# Altium schematic sheet Sheet2.SchDoc
size A3 portrait; SheetNumber: 1; SheetTotal: 1
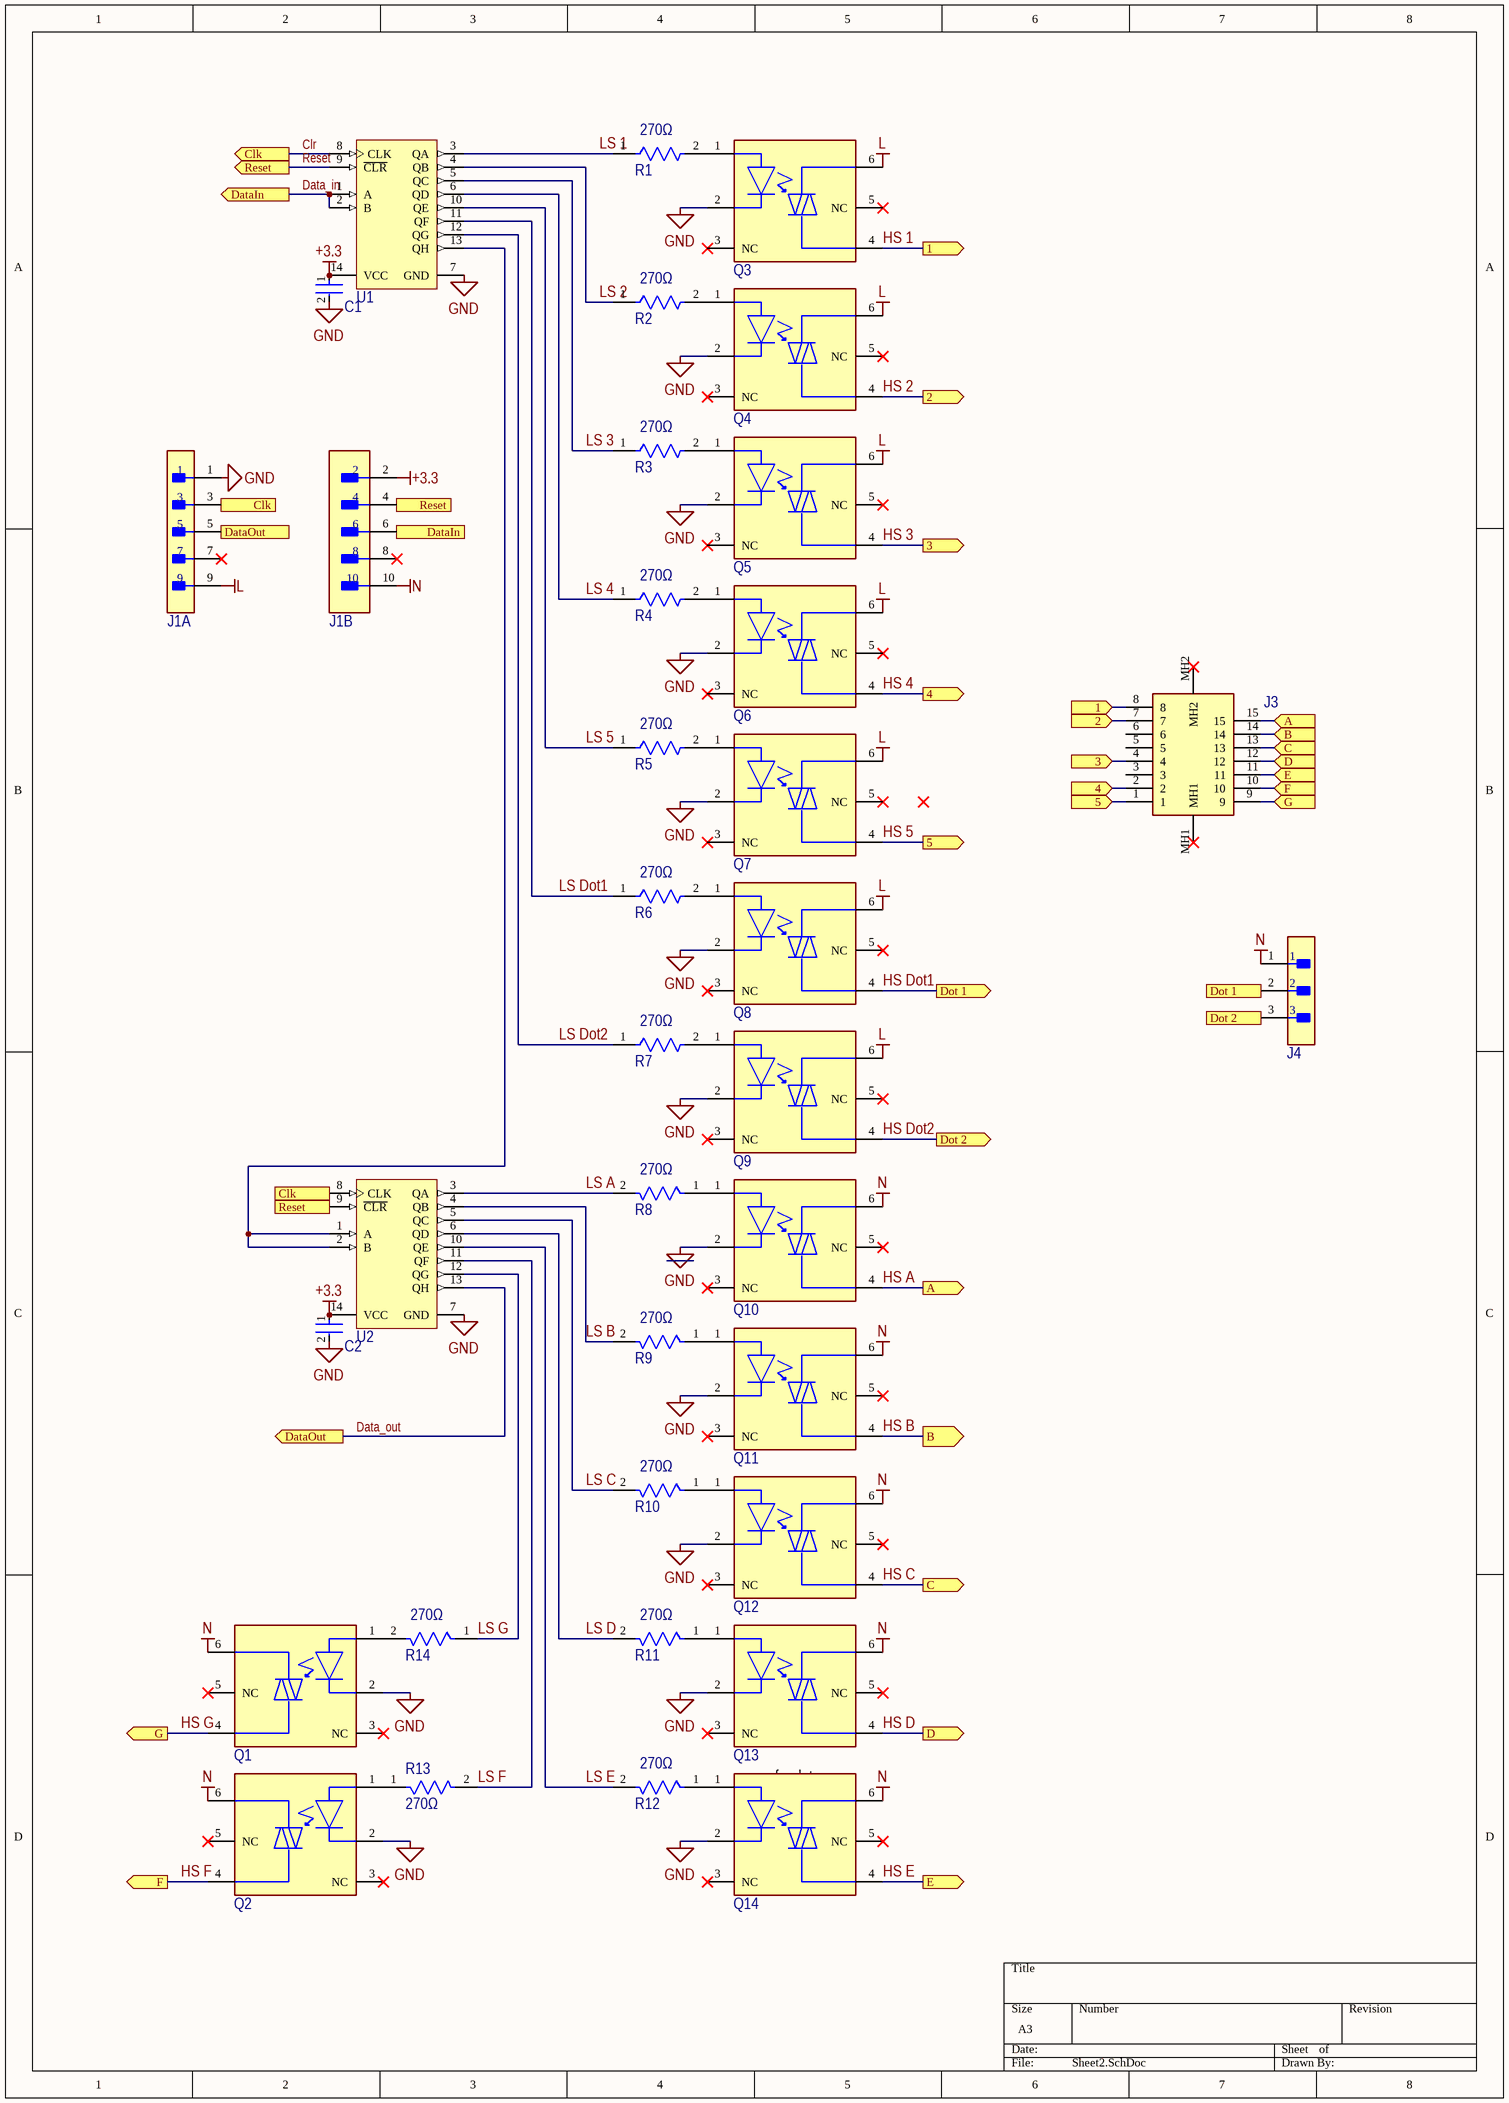
[diagram p0: Sheet2.SchDoc]

## Parts
C1  C0805C104M5RACTU  [FP-C0805C-DN-IPC_B]  (value not drawn)
C2  C0805C104M5RACTU  [FP-C0805C-DN-IPC_B]  (value not drawn)
J1  3220-10-0100-00  [FP-3220-10-0100-00-MFG]  (value not drawn)  (parts A,B of 2)
J3  2301828-1  [23018281]  (value not drawn)
J4  B3B-XH-A(LF)(SN)  [FP-B3B-XH-A_LF_SN-MFG]  (value not drawn)  (no BOM)
Q1  MOC3063SR2VM  [FP-646BY-MFG]  (value not drawn)
Q2  MOC3063SR2VM  [FP-646BY-MFG]  (value not drawn)
Q3  MOC3063SR2VM  [FP-646BY-MFG]  (value not drawn)
Q4  MOC3063SR2VM  [FP-646BY-MFG]  (value not drawn)
Q5  MOC3063SR2VM  [FP-646BY-MFG]  (value not drawn)
Q6  MOC3063SR2VM  [FP-646BY-MFG]  (value not drawn)
Q7  MOC3063SR2VM  [FP-646BY-MFG]  (value not drawn)
Q8  MOC3063SR2VM  [FP-646BY-MFG]  (value not drawn)
Q9  MOC3063SR2VM  [FP-646BY-MFG]  (value not drawn)
Q10  MOC3063SR2VM  [FP-646BY-MFG]  (value not drawn)
Q11  MOC3063SR2VM  [FP-646BY-MFG]  (value not drawn)
Q12  MOC3063SR2VM  [FP-646BY-MFG]  (value not drawn)
Q13  MOC3063SR2VM  [FP-646BY-MFG]  (value not drawn)
Q14  MOC3063SR2VM  [FP-646BY-MFG]  (value not drawn)
R1  value 270Ω  [FP-CRGCQ0603-IPC_C]  (hidden comment: CRGCQ0603F270R)
R2  value 270Ω  [FP-CRGCQ0603-IPC_C]  (hidden comment: CRGCQ0603F270R)
R3  value 270Ω  [FP-CRGCQ0603-IPC_C]  (hidden comment: CRGCQ0603F270R)
R4  value 270Ω  [FP-CRGCQ0603-IPC_C]  (hidden comment: CRGCQ0603F270R)
R5  value 270Ω  [FP-CRGCQ0603-IPC_C]  (hidden comment: CRGCQ0603F270R)
R6  value 270Ω  [FP-CRGCQ0603-IPC_C]  (hidden comment: CRGCQ0603F270R)
R7  value 270Ω  [FP-CRGCQ0603-IPC_C]  (hidden comment: CRGCQ0603F270R)
R8  value 270Ω  [FP-CRGCQ0603-IPC_C]  (hidden comment: CRGCQ0603F270R)
R9  value 270Ω  [FP-CRGCQ0603-IPC_C]  (hidden comment: CRGCQ0603F270R)
R10  value 270Ω  [FP-CRGCQ0603-IPC_C]  (hidden comment: CRGCQ0603F270R)
R11  value 270Ω  [FP-CRGCQ0603-IPC_C]  (hidden comment: CRGCQ0603F270R)
R12  value 270Ω  [FP-CRGCQ0603-IPC_C]  (hidden comment: CRGCQ0603F270R)
R13  value 270Ω  [FP-CRGCQ0603-IPC_C]  (hidden comment: CRGCQ0603F270R)
R14  value 270Ω  [FP-CRGCQ0603-IPC_C]  (hidden comment: CRGCQ0603F270R)
U1  SN74HC164DR  [D0014A_M]  (value not drawn)
U2  SN74HC164DR  [D0014A_M]  (value not drawn)

## Ports
1 (in, see Sheet2[3A]), 1 (out, see Sheet2[3C]), 2 (in, see Sheet2[3B]), 2 (out, see Sheet2[3C]), 3 (in, see Sheet2[3C]), 3 (out, see Sheet2[3C]), 4 (in, see Sheet2[3C]), 4 (out, see Sheet2[3C]), 5 (in, see Sheet2[3D]), 5 (out, see Sheet2[3D]), A (in, see Sheet2[3E]), A (out, see Sheet2[4C]), B (in, see Sheet2[3F]), B (out, see Sheet2[4C]), C (in, see Sheet2[3G]), C (out, see Sheet2[4C]), Clk (in, see Sheet2[1A], Sheet2[1E]), Clk (out, see Sheet2[1A], Sheet2[1B]), Clk (out, see Sheet2[1B], Sheet2[1E]), D (in, see Sheet2[3G]), D (out, see Sheet2[4C]), DataIn (in, see Sheet2[1A]), DataIn (out, see Sheet2[2C]), DataOut (out, see Sheet2[1C]), DataOut (out, see Sheet2[1F]), Dot 1 (in, see Sheet2[3D]), Dot 1 (out, see Sheet2[4D]), Dot 2 (in, see Sheet2[3E]), Dot 2 (out, see Sheet2[4D]), E (in, see Sheet2[3H]), E (out, see Sheet2[4C]), F (in, see Sheet2[1H]), F (out, see Sheet2[4C]), G (in, see Sheet2[1G]), G (out, see Sheet2[4D]), Reset (in, see Sheet2[1A], Sheet2[1E]), Reset (out, see Sheet2[1A], Sheet2[2B]), Reset (out, see Sheet2[1E], Sheet2[2B])

## Nets
+3.3: C1.1 C2.1 J1.2 U1.14(VCC) U2.14(VCC)
GND: C1.2 C2.2 J1.1 Q1.2(C) Q2.2(C) Q3.2(C) Q4.2(C) Q5.2(C) Q6.2(C) Q7.2(C) Q8.2(C) Q9.2(C) Q10.2(C) Q11.2(C) Q12.2(C) Q13.2(C) Q14.2(C) U1.7(GND) U2.7(GND)
L: J1.9 Q3.6(2_MAIN_TERM.) Q4.6(2_MAIN_TERM.) Q5.6(2_MAIN_TERM.) Q6.6(2_MAIN_TERM.) Q7.6(2_MAIN_TERM.) Q8.6(2_MAIN_TERM.) Q9.6(2_MAIN_TERM.)
N: J1.10 J4.1 Q1.6(2_MAIN_TERM.) Q2.6(2_MAIN_TERM.) Q10.6(2_MAIN_TERM.) Q11.6(2_MAIN_TERM.) Q12.6(2_MAIN_TERM.) Q13.6(2_MAIN_TERM.) Q14.6(2_MAIN_TERM.)
Clr: J1.3 U1.8(CLK) U2.8(CLK) ; port Clk
Data_in: J1.6 U1.1(A) U1.2(B) ; port DataIn
Data_out: J1.5 U2.13(QH) ; port DataOut
HS 1: J3.8 Q3.4(1_MAIN_TERM.) ; port 1
HS 2: J3.7 Q4.4(1_MAIN_TERM.) ; port 2
HS 3: J3.4 Q5.4(1_MAIN_TERM.) ; port 3
HS 4: J3.2 Q6.4(1_MAIN_TERM.) ; port 4
HS 5: J3.1 Q7.4(1_MAIN_TERM.) ; port 5
HS A: J3.15 Q10.4(1_MAIN_TERM.) ; port A
HS B: J3.14 Q11.4(1_MAIN_TERM.) ; port B
HS C: J3.13 Q12.4(1_MAIN_TERM.) ; port C
HS D: J3.12 Q13.4(1_MAIN_TERM.) ; port D
HS Dot1: J4.2 Q8.4(1_MAIN_TERM.) ; port Dot 1
HS Dot2: J4.3 Q9.4(1_MAIN_TERM.) ; port Dot 2
HS E: J3.11 Q14.4(1_MAIN_TERM.) ; port E
HS F: J3.10 Q2.4(1_MAIN_TERM.) ; port F
HS G: J3.9 Q1.4(1_MAIN_TERM.) ; port G
LS 1: R1.1 U1.3(QA)
LS 2: R2.1 U1.4(QB)
LS 3: R3.1 U1.5(QC)
LS 4: R4.1 U1.6(QD)
LS 5: R5.1 U1.10(QE)
LS A: R8.2 U2.3(QA)
LS B: R9.2 U2.4(QB)
LS C: R10.2 U2.5(QC)
LS D: R11.2 U2.6(QD)
LS Dot1: R6.1 U1.11(QF)
LS Dot2: R7.1 U1.12(QG)
LS E: R12.2 U2.10(QE)
LS F: R13.2 U2.11(QF)
LS G: R14.1 U2.12(QG)
Reset: J1.4 U1.9(~{CLR}) U2.9(~{CLR}) ; port Reset
NetQ1_1: Q1.1(A) R14.2
NetQ2_1: Q2.1(A) R13.1
NetQ3_1: Q3.1(A) R1.2
NetQ4_1: Q4.1(A) R2.2
NetQ5_1: Q5.1(A) R3.2
NetQ6_1: Q6.1(A) R4.2
NetQ7_1: Q7.1(A) R5.2
NetQ8_1: Q8.1(A) R6.2
NetQ9_1: Q9.1(A) R7.2
NetQ10_1: Q10.1(A) R8.1
NetQ11_1: Q11.1(A) R9.1
NetQ12_1: Q12.1(A) R10.1
NetQ13_1: Q13.1(A) R11.1
NetQ14_1: Q14.1(A) R12.1
NetU1_13: U1.13(QH) U2.1(A) U2.2(B)

Not connected (* = marked no-connect by the designer): J1 7* 8*; J3 3 5 6 MH1* MH2*; Q1 3(NC)* 5(NC)*; Q2 3(NC)* 5(NC)*; Q3 3(NC)* 5(NC)*; Q4 3(NC)* 5(NC)*; Q5 3(NC)* 5(NC)*; Q6 3(NC)* 5(NC)*; Q7 3(NC)* 5(NC)*; Q8 3(NC)* 5(NC)*; Q9 3(NC)* 5(NC)*; Q10 3(NC)* 5(NC)*; Q11 3(NC)* 5(NC)*; Q12 3(NC)* 5(NC)*; Q13 3(NC)* 5(NC)*; Q14 3(NC)* 5(NC)*

## Notes on the sheet
- (near Q14) for dots

## Library data of the parts
C1 C2 = CMP-1036-04423-3: CAP CER 0.1UF 50V X7R 0805; Manufacturer: KEMET; Tolerance: 0.2; Description: C0805 0.10 μF X7R 30ppm/°C 20.00% 50 V; Temperature Coefficient: 30ppm/°C; Material: Ceramic; Capacitance: 0.10 μF; Value: 0.10 μF; Temperature: -55°C to +125°C; RoHS: TRUE; Temperature Range Low: -55°C; Device Class L3: Ceramic Capacitors; Manufacturer Part Number: C0805C104M5RACTU; Octopart: https://octopart.com/c0805c104m5ractu-kemet-129379; Ipc Land Pattern Name: CAPC200125X78; Mouser Description: Multilayer Ceramic Capacitors MLCC - SMD/SMT 50volts 0.1uF X7R 20%; Temperature Range High: +125°C; Package: C0805C-DN; Temperature Characteristic: X7R; Automotive: No; ComponentLink2URL: https://content.kemet.com/datasheets/KEM_C1003_C0G_SMD.pdf; Device Class L1: Passive Components; ComponentLink2Description: Datasheet; Device Class L2: Capacitors; Voltage Rating: 50 V; Digikey Description: CAP CER 0.1UF 50V X7R 0805; Lead Free: Yes; Height: 0.88mm; Category: Cap
J1 = CMP-04151-26714221-1: 3220-10-0100-00 Conn Shrouded Header (4 Sides) HDR 10 POS 1.27mm Solder ST Top Entry Thru-Hole; Current Rating: 1A; Number of Contacts: 10; Connector Type: Male Pin; Contact Plating: Gold; Max Operating Temperature: 105°C; Contact Material: Gold; Number of Positions: 10; Pitch: 1.27mm; Number of Rows: 2; RoHS: Compliant; Row Spacing: 1.27mm; Min Operating Temperature: -40°C; Termination: Solder; NexarPartId: 26714221; Height: 5.6mm; Mount: Through Hole
J3 = 2301828-1: Body Features: Connector Profile High; Manufacturer_Name: TE Connectivity; Geometry.Height: 12.48mm; Manufacturer_Part_Number: 2301828-1; Mouser Part Number: 571-2301828-1; Mouser Price/Stock: https://www.mouser.co.uk/ProductDetail/TE-Connectivity/2301828-1?qs=byeeYqUIh0OzT0Qo7TiYRg%3D%3D; Arrow Part Number: 2301828-1; Arrow Price/Stock: https://www.arrow.com/en/products/2301828-1/te-connectivity; Datasheet Link: https://www.arrow.com/en/products/2301828-1/te-connectivity
J4 = CMP-17439-000014-3: CONN HEADER VERT 3POS 2.5MM; Max Voltage Rating (DC): 250V; Number of Positions: 3; Current Rating: 3A; Gender: Male; Wire/Cable Gauge: 22AWG; Contact Resistance: 20mR; Insulation Resistance: 1GR; Insulation Material: Nylon; Contact Plating: Tin; Depth: 5.75mm; Contact Type: Male Pin; Max Operating Temperature: 85°C; Insulation Color: Natural; Voltage Rating (AC): 250V; Color: Natural; Connector Type: Header; Orientation: Straight; Fastening Type: Detent; Housing Color: White; Min Operating Temperature: -25°C; Termination: Solder; Voltage Rating: 250V; Series: XH; Pitch: 2.5mm; Contact Shape: Square; Number of Rows: 1; Lead Free: Lead Free; Packaging: Bulk; Mount: Through Hole; Flammability Rating: UL94 V-0; Max Voltage Rating (AC): 250V; REACH SVHC: No SVHC; Housing Material: Polyamide; Contact Material: Brass; Lead Pitch: 2.5mm; Contact Finish - Mating: TIN; Length: 9.9mm; Max Current Rating: 3A; Number of Contacts: 3
Q1-Q14 = CMP-07144-000012-1: OPTOISOLATOR 4.17KV TRIAC 6SMD; Manufacturer: ON Semiconductor; Standoff Height: 0.38mm; Max Junction Temp: +100°C; Power Dissipation: 250mW; Reverse Voltage: 6V; Isolation Voltage: 4170Vrms; Forward Voltage: 1.3V; Forward Current: 30mA; Temperature Range High: +85°C; Category: Trans; Device Class L2: Optocouplers; Temperature Range Low: -40°C; Mouser Description: Triac Driver Output Optocoupler, 6-Pin DIP 600V Zero Crossing; Octopart: https://octopart.com/moc3063sr2vm-on+semiconductor-84330447; Digikey Description: OPTOISOLATOR 4.17KV TRIAC 6SMD; ComponentLink2URL: https://www.onsemi.com/pub/Collateral/MOC3163M-D.pdf; ComponentLink2Description: Datasheet; Manufacturer Part Number: MOC3063SR2VM; Lead Free: Yes; Device Class L3: unset; Device Class L1: Optoelectronics; Automotive: No; Height: 4.8mm; Package: 646BY; Footprint Url: https://www.onsemi.com/pub/Collateral/646BY.PDF; RoHS: TRUE; Temperature: -40°C to +85°C
R1-R14 = CMP-03211-000598-1: CRGCQ0603 270Ω 1% ±100ppm/°C 75V; Manufacturer: TE Connectivity; Tolerance: 0.01; Power Rating: 0.1W; ComponentLink2URL: https://www.te.com/commerce/DocumentDelivery/DDEController?Action=showdoc&DocId=Data+Sheet%7F1773204-3%7F1%7Fpdf%7FEnglish%7FENG_DS_1773204-3_1.pdf%7F4-2176339-560; Manufacturer Part Number: CRGCQ0603F270R; Ambient Temperature Range High: +70°C; Voltage Rating: 75V; Octopart: https://octopart.com/crgcq0603f270r-te+connectivity-91018060; Temperature Range High: +155°C; Device Class L2: Resistors; Lead Free: Yes; Temperature Coefficient: ±100ppm/°C; Temperature: -55°C to +155°C; Device Class L1: Passive Components; Package: CRGCQ0603; Ipc Land Pattern Name: RESC16080X45; Category: Res; ComponentLink2Description: Datasheet; Temperature Range Low: -55°C; Device Class L3: Chip SMD Resistors; RoHS: TRUE; Series: CRGCQ; Resistance: 270Ω; Composition: Thick Film; Height: 0.55mm
U1 U2 = CMP-0780-00006-3: 8-Bit Parallel-Out Serial Shift Registers, D0014A, LARGE T&R; Manufacturer: Texas Instruments; 3-State Output: No; F @ Nom Voltage(Max)(Mhz): 28; Bits: 8; Output Type: CMOS; VCC(Max)(V): 6; Technology Family: HC; VCC(Min)(V): 2; tpd @ Nom Voltage(Max)(ns): 38; ICC @ Nom Voltage(Max)(mA): 0.08; Rating: Catalog; Output Drive (IOL/IOH)(Max)(mA): 5.2/-5.2; PackageVersion: http://www.ti.com/lit/ml/mpds177g/mpds177g.pdf; Voltage(Nom)(V): 6; Code_JEDEC: MS-012; DatasheetVersion: SCLS115F; Generic Part Number: SN74HC164; Operating Temperature Range(C): -40 to 125; Input Type: CMOS; PackageReference: D0014A